# Altium schematic sheet Структурная схема мониторинга.SchDoc: Структурная схема мониторинга
size A4; PageSetup: Record=PageOptions|CenterHorizontal=True|CenterVertical=True|PrintScale=1.00|XCorrection=1.00|YCorrection=1.00|PrintKind=0|BorderSize=5000000|LeftOffset=0|BottomOffset=0|Orientation=2|PaperLength=1000|PaperWidth=1000|Scale=100|PaperSource=7|PrintQuality=-3|MediaType=1|DitherType=10|PrintScaleMode=1|PaperKind=A4|PaperIndex=9
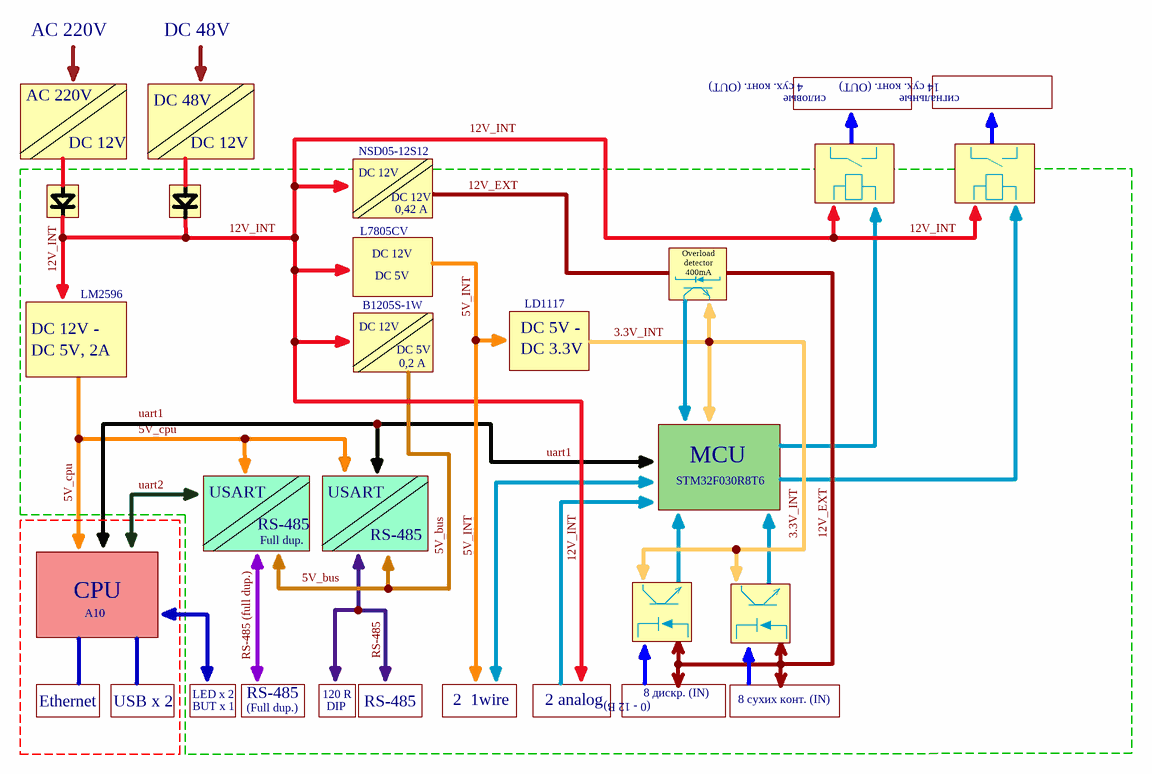
[diagram p0: Структурная схема мониторинга.SchDoc]

## Notes on the sheet
- AC 220V
- DC 48V
- 4 сух. конт. (OUT)
- силовые
- 14 сух. конт. (OUT)
- сигнальные
- DC 12V
- NSD05-12S12
- L7805CV
- 0,42 A
- LM2596
- B1205S-1W
- DC 5V
- LD1117
- Overload detector 400mA
- DC 12V -
- DC 5V, 2A
- 0,2 A
- DC 5V -
- DC 3.3V
- USART
- STM32F030R8T6
- MCU
- RS-485
- Full dup.
- CPU
- A10
- Ethernet
- USB x 2
- LED x 2
- BUT x 1
- (Full dup.)
- 120 R
- DIP
- 2  1wire
- 2 analog
- 8 дискр. (IN)
- (0 - 12 В)
- 8 сухих конт. (IN)
- Labels drawn without touching a wire or pin: 3.3V_INT, 5V_bus, 5V_cpu, 5V_INT, 12V_EXT, 12V_INT, RS-485, RS-485 (full dup.), uart1, uart2
- Title
- Size:
- Date:
- A4
- Number:
- Time:
- Revision:
- Sheet
- of
- File: